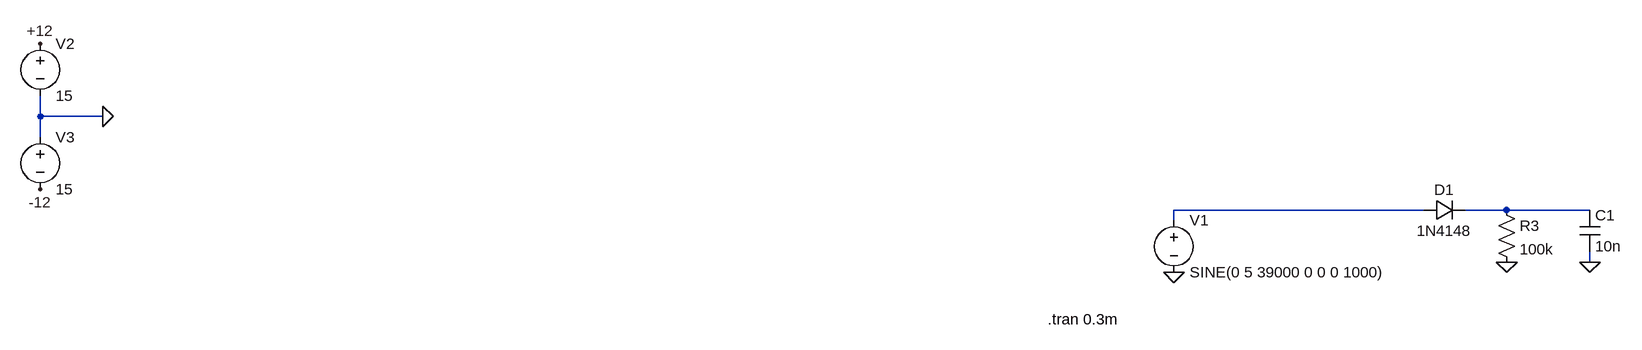
[diagram p0: schematic Montage 6.asc]
Montage 6.asc, the LTspice schematic file:
Version 4
SHEET 1 948 680
WIRE -1664 96 -1664 64
WIRE -1568 96 -1664 96
WIRE -1664 128 -1664 96
WIRE 464 240 80 240
WIRE 592 240 528 240
WIRE 720 240 592 240
WIRE 80 256 80 240
WIRE 720 320 720 304
FLAG -1664 -16 +12
FLAG -1664 208 -12
FLAG -1568 96 0
FLAG 80 336 0
FLAG 592 320 0
FLAG 720 320 0
SYMBOL voltage -1664 112 R0
WINDOW 123 0 0 Left 0
WINDOW 39 0 0 Left 0
SYMATTR InstName V3
SYMATTR Value 15
SYMBOL voltage -1664 -32 R0
WINDOW 123 0 0 Left 0
WINDOW 39 0 0 Left 0
SYMATTR InstName V2
SYMATTR Value 15
SYMBOL voltage 80 240 R0
WINDOW 123 0 0 Left 0
WINDOW 39 0 0 Left 0
SYMATTR InstName V1
SYMATTR Value SINE(0 5 39000 0 0 0 1000)
SYMBOL diode 464 256 R270
WINDOW 0 32 32 VTop 2
WINDOW 3 0 32 VBottom 2
SYMATTR InstName D1
SYMATTR Value 1N4148
SYMBOL res 576 224 R0
SYMATTR InstName R3
SYMATTR Value 100k
SYMBOL cap 704 240 R0
SYMATTR InstName C1
SYMATTR Value 10n
TEXT -114 408 Left 2 !.tran 0.3m

The netlist it stands for:
* Montage 6.asc
V3 0 -12 15
V2 +12 0 15
V1 N001 0 SINE(0 5 39000 0 0 0 1000)
D1 N001 N002 1N4148
R3 N002 0 100k
C1 N002 0 10n
.model D D
.lib standard.dio
.tran 0.3m
.backanno
.end